# Altium schematic sheet Public_CPU_QSGMII_ETHERNET_TRANSCEIVER_0.SchDoc
size D
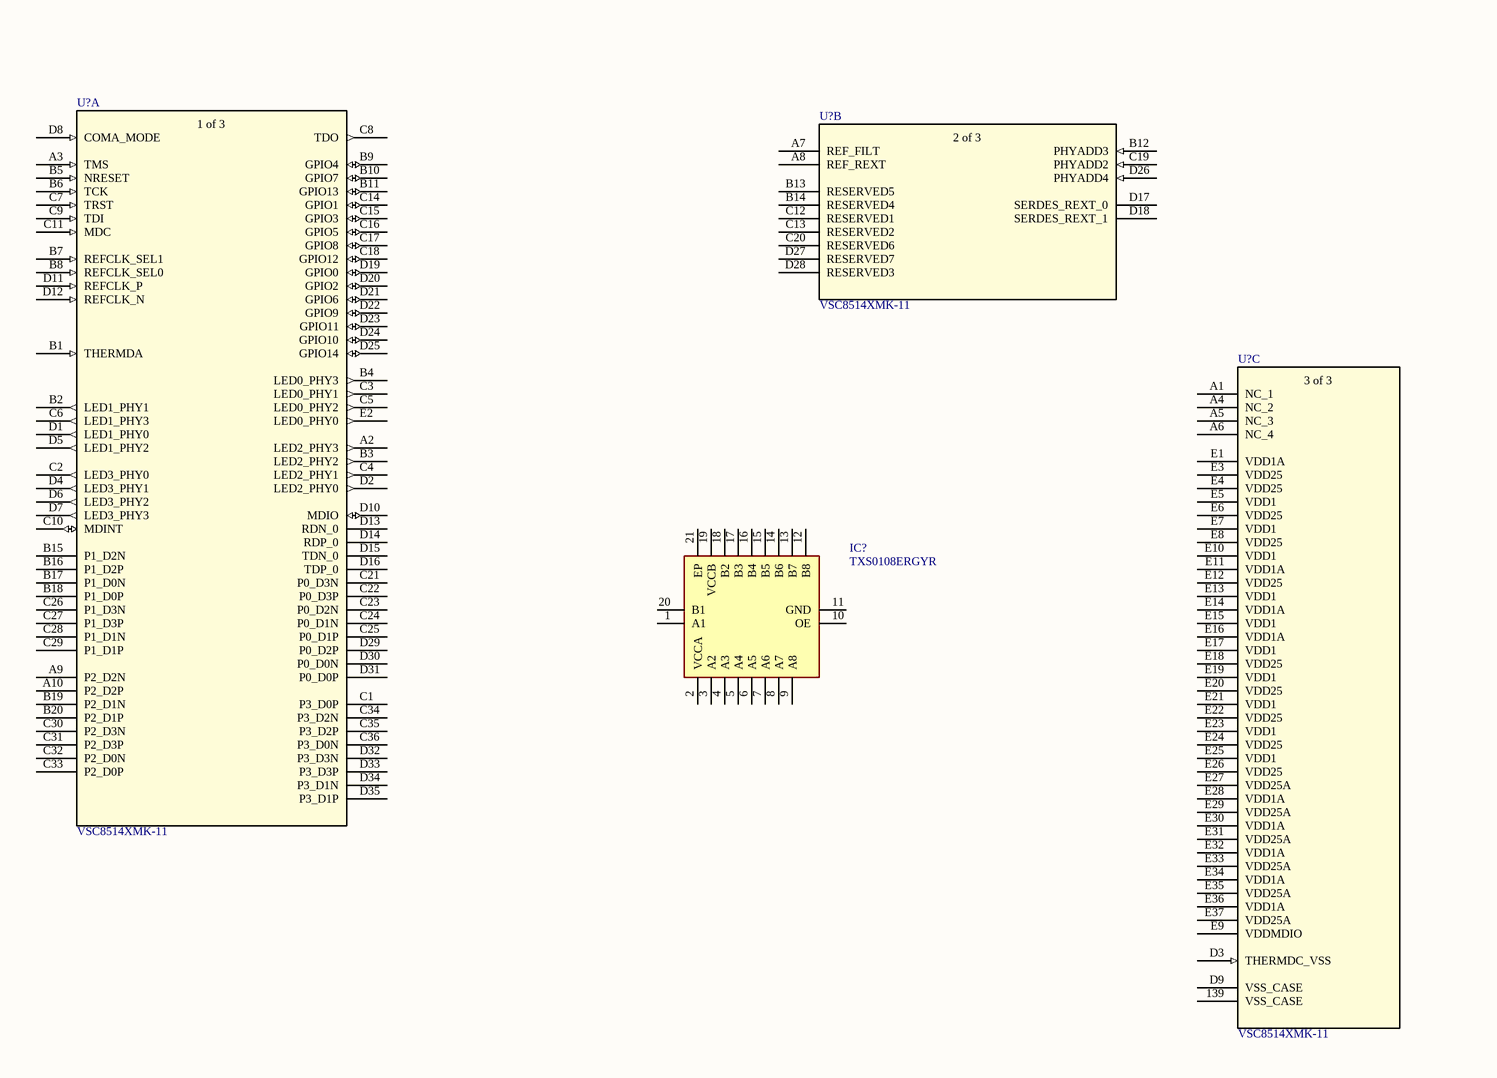
[diagram p0: Public_CPU_QSGMII_ETHERNET_TRANSCEIVER_0.SchDoc, left]
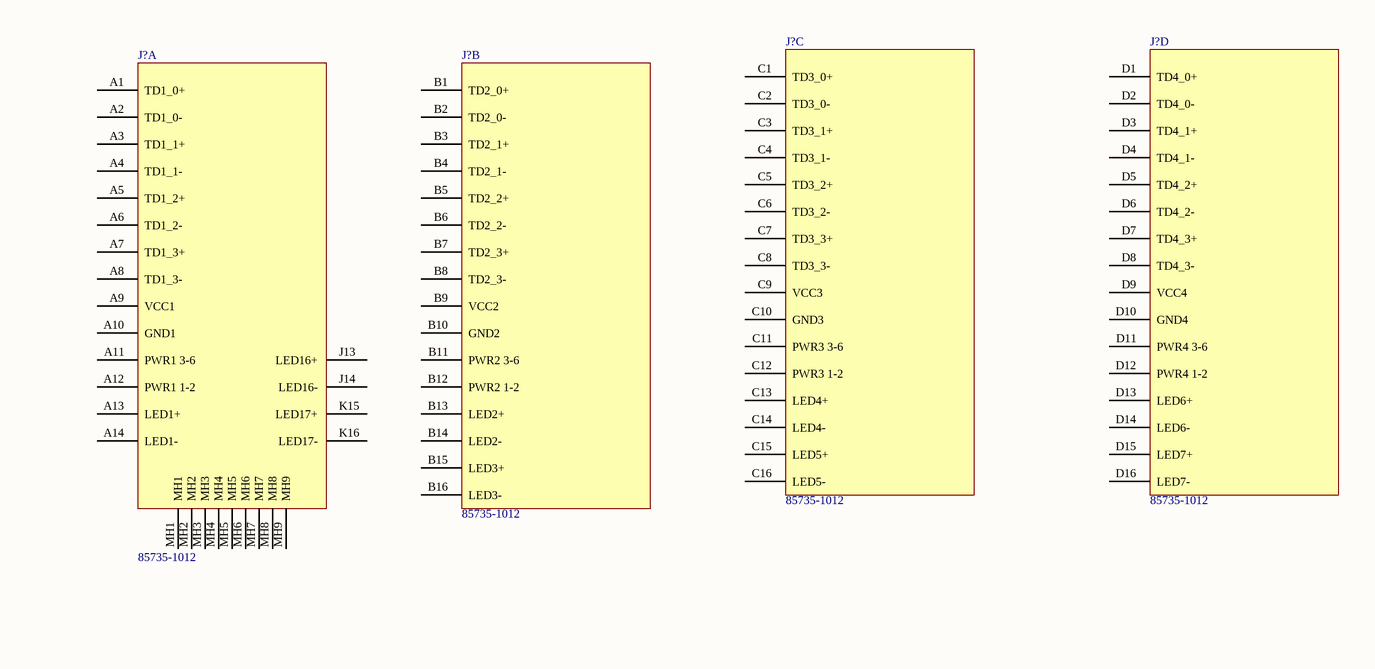
[diagram p1: Public_CPU_QSGMII_ETHERNET_TRANSCEIVER_0.SchDoc, right]

## Parts
(Parts that share a designator on the sheet are numbered #1, #2 ... from top to bottom, then left to right.)
IC?  TXS0108ERGYR  [SN74LVC541ARGYR]
J?#1  85735-1012  [857351012]  (part C of 8)
J?#2  85735-1012  [857351012]  (part D of 8)
J?#3  85735-1012  [857351012]  (part A of 8)
J?#4  85735-1012  [857351012]  (part B of 8)
U?#1  VSC8514XMK-11  [QFN138_12X12X0P85_MCH]  (part A of 3)
U?#2  VSC8514XMK-11  [QFN138_12X12X0P85_MCH]  (part B of 3)
U?#3  VSC8514XMK-11  [QFN138_12X12X0P85_MCH]  (part C of 3)

## Nets

Not connected (* = marked no-connect by the designer): IC? 1(A1) 2(VCCA) 3(A2) 4(A3) 5(A4) 6(A5) 7(A6) 8(A7) 9(A8) 10(OE) 11(GND) 12(B8) 13(B7) 14(B6) 15(B5) 16(B4) 17(B3) 18(B2) 19(VCCB) 20(B1) 21(EP); J?#1 C1(TD3_0+) C2(TD3_0-) C3(TD3_1+) C4(TD3_1-) C5(TD3_2+) C6(TD3_2-) C7(TD3_3+) C8(TD3_3-) C9(VCC3) C10(GND3) C11(PWR3_3-6) C12(PWR3_1-2) C13(LED4+) C14(LED4-) C15(LED5+) C16(LED5-); J?#2 D1(TD4_0+) D2(TD4_0-) D3(TD4_1+) D4(TD4_1-) D5(TD4_2+) D6(TD4_2-) D7(TD4_3+) D8(TD4_3-) D9(VCC4) D10(GND4) D11(PWR4_3-6) D12(PWR4_1-2) D13(LED6+) D14(LED6-) D15(LED7+) D16(LED7-); J?#3 A1(TD1_0+) A2(TD1_0-) A3(TD1_1+) A4(TD1_1-) A5(TD1_2+) A6(TD1_2-) A7(TD1_3+) A8(TD1_3-) A9(VCC1) A10(GND1) A11(PWR1_3-6) A12(PWR1_1-2) A13(LED1+) A14(LED1-) J13(LED16+) J14(LED16-) K15(LED17+) K16(LED17-) MH1 MH2 MH3 MH4 MH5 MH6 MH7 MH8 MH9; J?#4 B1(TD2_0+) B2(TD2_0-) B3(TD2_1+) B4(TD2_1-) B5(TD2_2+) B6(TD2_2-) B7(TD2_3+) B8(TD2_3-) B9(VCC2) B10(GND2) B11(PWR2_3-6) B12(PWR2_1-2) B13(LED2+) B14(LED2-) B15(LED3+) B16(LED3-); U?#1 A2(LED2_PHY3) A3(TMS) A9(P2_D2N) A10(P2_D2P) B1(THERMDA) B2(LED1_PHY1) B3(LED2_PHY2) B4(LED0_PHY3) B5(NRESET) B6(TCK) B7(REFCLK_SEL1) B8(REFCLK_SEL0) B9(GPIO4) B10(GPIO7) B11(GPIO13) B15(P1_D2N) B16(P1_D2P) B17(P1_D0N) B18(P1_D0P) B19(P2_D1N) B20(P2_D1P) C1(P3_D0P) C2(LED3_PHY0) C3(LED0_PHY1) C4(LED2_PHY1) C5(LED0_PHY2) C6(LED1_PHY3) C7(TRST) C8(TDO) C9(TDI) C10(MDINT) C11(MDC) C14(GPIO1) C15(GPIO3) C16(GPIO5) C17(GPIO8) C18(GPIO12) C21(P0_D3N) C22(P0_D3P) C23(P0_D2N) C24(P0_D1N) C25(P0_D1P) C26(P1_D3N) C27(P1_D3P) C28(P1_D1N) C29(P1_D1P) C30(P2_D3N) C31(P2_D3P) C32(P2_D0N) C33(P2_D0P) C34(P3_D2N) C35(P3_D2P) C36(P3_D0N) D1(LED1_PHY0) D2(LED2_PHY0) D4(LED3_PHY1) D5(LED1_PHY2) D6(LED3_PHY2) D7(LED3_PHY3) D8(COMA_MODE) D10(MDIO) D11(REFCLK_P) D12(REFCLK_N) D13(RDN_0) D14(RDP_0) D15(TDN_0) D16(TDP_0) D19(GPIO0) D20(GPIO2) D21(GPIO6) D22(GPIO9) D23(GPIO11) D24(GPIO10) D25(GPIO14) D29(P0_D2P) D30(P0_D0N) D31(P0_D0P) D32(P3_D3N) D33(P3_D3P) D34(P3_D1N) D35(P3_D1P) E2(LED0_PHY0); U?#2 A7(REF_FILT) A8(REF_REXT) B12(PHYADD3) B13(RESERVED5) B14(RESERVED4) C12(RESERVED1) C13(RESERVED2) C19(PHYADD2) C20(RESERVED6) D17(SERDES_REXT_0) D18(SERDES_REXT_1) D26(PHYADD4) D27(RESERVED7) D28(RESERVED3); U?#3 139(VSS_CASE) A1(NC_1) A4(NC_2) A5(NC_3) A6(NC_4) D3(THERMDC_VSS) D9(VSS_CASE) E1(VDD1A) E3(VDD25) E4(VDD25) E5(VDD1) E6(VDD25) E7(VDD1) E8(VDD25) E9(VDDMDIO) E10(VDD1) E11(VDD1A) E12(VDD25) E13(VDD1) E14(VDD1A) E15(VDD1) E16(VDD1A) E17(VDD1) E18(VDD25) E19(VDD1) E20(VDD25) E21(VDD1) E22(VDD25) E23(VDD1) E24(VDD25) E25(VDD1) E26(VDD25) E27(VDD25A) E28(VDD1A) E29(VDD25A) E30(VDD1A) E31(VDD25A) E32(VDD1A) E33(VDD25A) E34(VDD1A) E35(VDD25A) E36(VDD1A) E37(VDD25A)

## Notes on the sheet
- Title
- Size:
- Date:
- File:
- D
- Number:
- Time:
- Revision:
- Sheet
- of
- (in symbol VSC8514XMK-11, part A) 1 of 3
- (in symbol VSC8514XMK-11, part B) 2 of 3
- (in symbol VSC8514XMK-11, part C) 3 of 3

## Library data of the parts
IC? = TXS0108ERGYR: Integrated Circuit; Manufacturer_Name: Texas Instruments; Datasheet Link: http://www.ti.com/lit/gpn/txs0108e; Height: 1mm; Manufacturer_Part_Number: TXS0108ERGYR; Mouser Part Number: 595-TXS0108ERGYR; Mouser Price/Stock: https://www.mouser.co.uk/ProductDetail/Texas-Instruments/TXS0108ERGYR/?qs=dqESbKqT1jau1kZv8JPj9Q%3D%3D; Arrow Part Number: TXS0108ERGYR; Arrow Price/Stock: https://www.arrow.com/en/products/txs0108ergyr/texas-instruments
J?#1-J?#4 = 85735-1012: Connector; Manufacturer_Name: Molex; Datasheet Link: https://www.molex.com/pdm_docs/sd/857351012_sd.pdf; Height: 25.71mm; Manufacturer_Part_Number: 85735-1012; Mouser Part Number: N/A; Mouser Price/Stock: https://www.mouser.co.uk/ProductDetail/Molex/85735-1012?qs=yd8XiKYcH9lIdOAreapLrg%3D%3D
U?#1-U?#3 = VSC8514XMK-11: No Description Available; SourceLibrary: Microchip_2020-10-14; Built_By: EMA_Cory; Vendor: Microchip; Datasheet: https://ww1.microchip.com/downloads/en/DeviceDoc/VMDS-10446.pdf; Copyright: Copyright (C) 2018 Accelerated Designs. All rights reserved; Manufacturer_Part_Number: VSC8514XMK-11; RefDes: RefDes; Type: DEV